# Altium schematic sheet Ponte_H.SchDoc
size A4
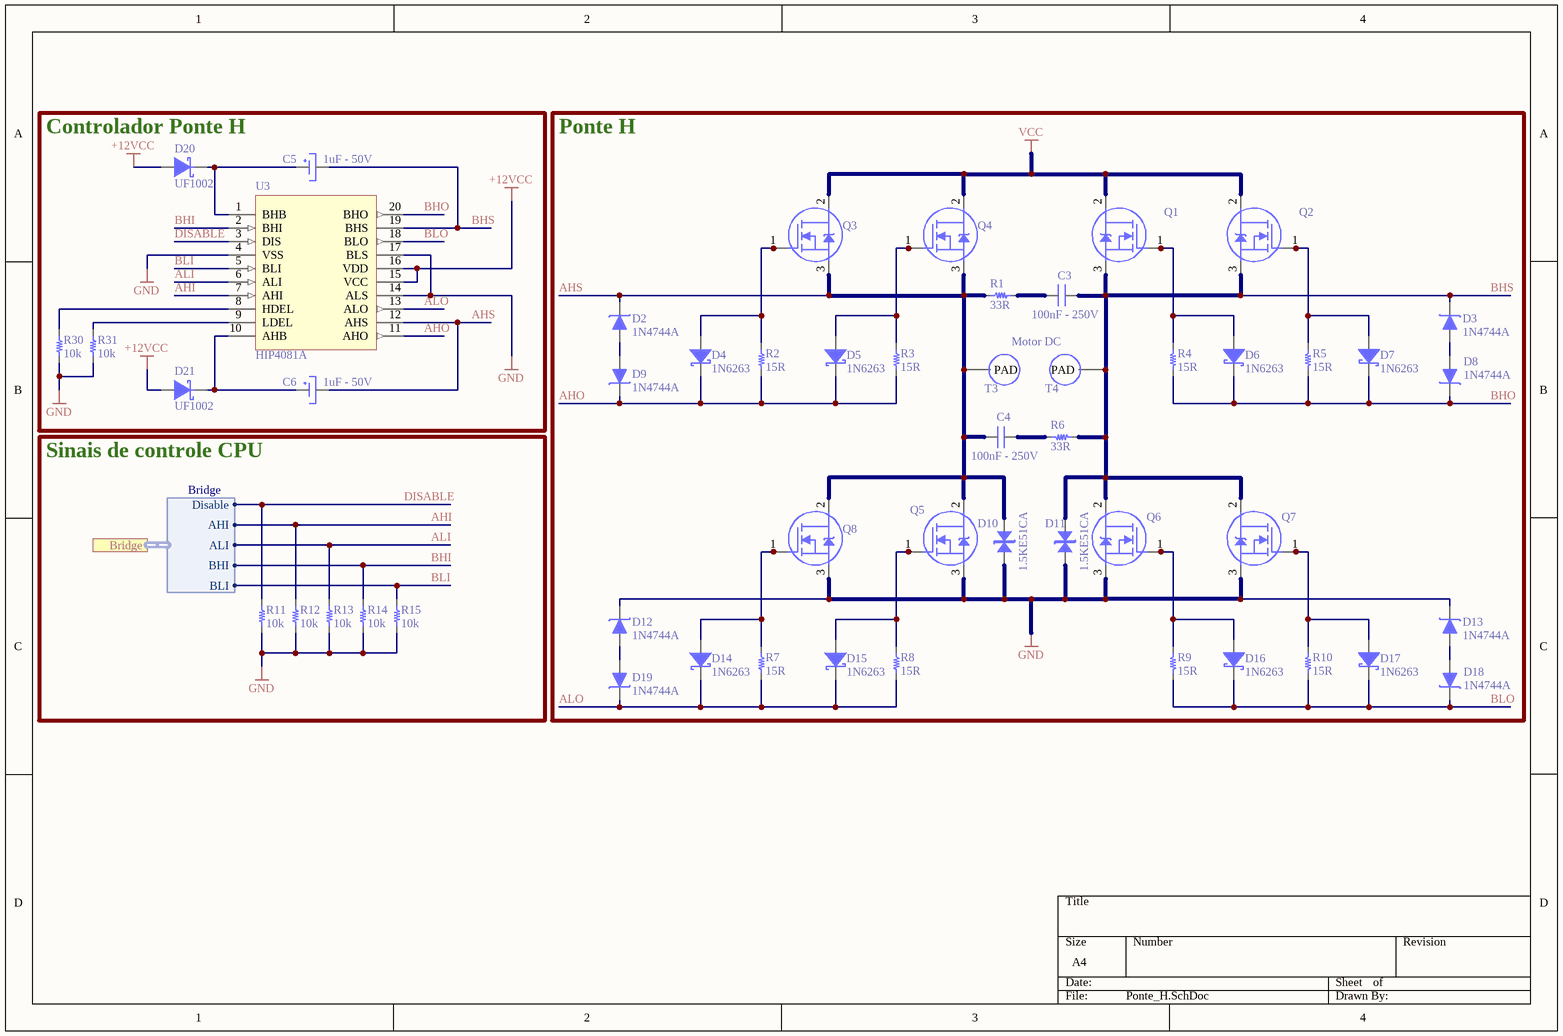
[diagram p0: Ponte_H.SchDoc]

## Parts
C3  100nF - 250V  [Capacitor_PTH]
C4  100nF - 250V  [Capacitor_PTH]
C5  1uF - 50V  [CAPACITOR_SMD]
C6  1uF - 50V  [CAPACITOR_SMD]
D2  1N4744A  [Diode_PHT]
D3  1N4744A  [Diode_PHT]
D4  1N6263  [Diode_PHT]
D5  1N6263  [Diode_PHT]
D6  1N6263  [Diode_PHT]
D7  1N6263  [Diode_PHT]
D8  1N4744A  [Diode_PHT]
D9  1N4744A  [Diode_PHT]
D10  1.5KE51CA  [DO-201]
D11  1.5KE51CA  [DO-201]
D12  1N4744A  [Diode_PHT]
D13  1N4744A  [Diode_PHT]
D14  1N6263  [Diode_PHT]
D15  1N6263  [Diode_PHT]
D16  1N6263  [Diode_PHT]
D17  1N6263  [Diode_PHT]
D18  1N4744A  [Diode_PHT]
D19  1N4744A  [Diode_PHT]
D20  UF1002  [Diode_PHT]
D21  UF1002  [Diode_PHT]
Q1  IRF1405  [TO-220AB]  (value not drawn)
Q2  IRF1405  [TO-220AB]  (value not drawn)
Q3  IRF1405  [TO-220AB]  (value not drawn)
Q4  IRF1405  [TO-220AB]  (value not drawn)
Q5  IRF1405  [TO-220AB]  (value not drawn)
Q6  IRF1405  [TO-220AB]  (value not drawn)
Q7  IRF1405  [TO-220AB]  (value not drawn)
Q8  IRF1405  [TO-220AB]  (value not drawn)
R1  33R  [Resistor_PTH]
R2  15R  [R_0805]
R3  15R  [R_0805]
R4  15R  [R_0805]
R5  15R  [R_0805]
R6  33R  [Resistor_PTH]
R7  15R  [R_0805]
R8  15R  [R_0805]
R9  15R  [R_0805]
R10  15R  [R_0805]
R11  10k  [R_0805]
R12  10k  [R_0805]
R13  10k  [R_0805]
R14  10k  [R_0805]
R15  10k  [R_0805]
R30  10k  [R_0805]
R31  10k  [R_0805]
T3  Power_Pad  [Power_Pad]  (value not drawn)
T4  Power_Pad  [Power_Pad]  (value not drawn)
U3  HIP4081A  [PDIP20]

## Blocks framed on the sheet
Controlador Ponte H: C5 C6 D20 D21 R30 R31 U3
Ponte H: C3 C4 D2-D19 Q1-Q8 R1-R10 T3 T4
Sinais de controle CPU: R11-R15

## Ports
Bridge (harness Bridge)

## Harnesses
Bridge: Disable, AHI, ALI, BHI, BLI

## Nets
+12VCC: D20.A(Anodo) D21.A(Anodo) U3.15(VCC) U3.16(VDD)
GND: D10.A(Anodo) D11.A(Anodo) D12.K(Catodo) D13.K(Catodo) Q5.3(Source) Q6.3(Source) Q7.3(Source) Q8.3(Source) R11.1 R12.1 R13.1 R14.1 R15.1 R30.1 R31.1 U3.4(VSS) U3.14(ALS) U3.17(BLS)
VCC: Q1.2(Drain) Q2.2(Drain) Q3.2(Drain) Q4.2(Drain)
AHI: R12.2 U3.7(AHI) ; port Bridge.AHI
AHO: D4.K(Catodo) D5.K(Catodo) D9.K(Catodo) R2.1 R3.1 U3.11(AHO)
AHS: C4.1 C6.1 D2.K(Catodo) D10.K(Catodo) Q3.3(Source) Q4.3(Source) Q5.2(Drain) Q8.2(Drain) R1.1 T3.1(PAD) U3.12(AHS)
ALI: R13.2 U3.6(ALI) ; port Bridge.ALI
ALO: D14.K(Catodo) D15.K(Catodo) D19.K(Catodo) R7.1 R8.1 U3.13(ALO)
BHI: R14.2 U3.2(BHI) ; port Bridge.BHI
BHO: D6.K(Catodo) D7.K(Catodo) D8.K(Catodo) R4.1 R5.1 U3.20(BHO)
BHS: C3.1 C5.1 D3.K(Catodo) D11.K(Catodo) Q1.3(Source) Q2.3(Source) Q6.2(Drain) Q7.2(Drain) R6.1 T4.1(PAD) U3.19(BHS)
BLI: R15.2 U3.5(BLI) ; port Bridge.BLI
BLO: D16.K(Catodo) D17.K(Catodo) D18.K(Catodo) R9.1 R10.1 U3.18(BLO)
DISABLE: R11.2 U3.3(DIS) ; port Bridge.Disable
NetC3_2: C3.2 R1.2
NetC4_2: C4.2 R6.2
NetC5_2: C5.2 D20.K(Catodo) U3.1(BHB)
NetC6_2: C6.2 D21.K(Catodo) U3.10(AHB)
NetD2_A: D2.A(Anodo) D9.A(Anodo)
NetD3_A: D3.A(Anodo) D8.A(Anodo)
NetD4_A: D4.A(Anodo) Q3.1(Gate) R2.2
NetD5_A: D5.A(Anodo) Q4.1(Gate) R3.2
NetD6_A: D6.A(Anodo) Q1.1(Gate) R4.2
NetD7_A: D7.A(Anodo) Q2.1(Gate) R5.2
NetD12_A: D12.A(Anodo) D19.A(Anodo)
NetD13_A: D13.A(Anodo) D18.A(Anodo)
NetD14_A: D14.A(Anodo) Q8.1(Gate) R7.2
NetD15_A: D15.A(Anodo) Q5.1(Gate) R8.2
NetD16_A: D16.A(Anodo) Q6.1(Gate) R9.2
NetD17_A: D17.A(Anodo) Q7.1(Gate) R10.2
NetR30_2: R30.2 U3.8(HDEL)
NetR31_2: R31.2 U3.9(LDEL)

## Notes on the sheet
- Motor DC

## Library data of the parts
C3 C4 = 100nF - 250V: Capacitor_100nF Poliester; Supplier Part Number 1: 495-2426-ND; Supplier 1: Digi-Key
C5 C6 = 1uF - 50V: Capacitor_1uF_50V; ComponentLink1Description: Datasheet; ComponentLink1URL: https://industrial.panasonic.com/cdbs/www-data/pdf/RDF0000/ABA0000C1209.pdf; Supplier 2: Mouser; Supplier Part Number 1: P11276-ND; Supplier Part Number 2: 667-EEU-FC1J681S; Supplier 1: Digi-Key
D2 D3 D8 D9 D12 D13 D18 D19 = 1N4744A: Diodo Zener 15V 200mA; ComponentLink1Description: Datasheet; ComponentLink1URL: https://www.diodes.com/assets/Datasheets/ds25002.pdf; Supplier 1: Mouser; Supplier Part Number 1: 821-1N4744A
D4-D7 D14-D17 = 1N6263: Diodo Schottky 60V - 15mA; Supplier 1: Digi-Key; Supplier Part Number 1: 497-2508-1-ND
D10 D11 = 1.5KE51CA: Transzorb; Supplier Part Number 1: 576-1.5KE51CA; Supplier 1: Mouser
D20 D21 = UF1002: UltraFast Diode 1.0A; Supplier Part Number 1: 621-UF1002-T; ComponentLink1Description: Datasheet; ComponentLink1URL: https://www.diodes.com/assets/Datasheets/ds25002.pdf; Supplier 1: Mouser
Q1-Q8 = IRF1405: MOSFET transistor; Supplier 1: Digi-Key; Supplier 2: Mouser; Supplier Part Number 1: IRF1405PBF-ND; Supplier Part Number 2: 942-IRF1405PBF; ComponentLink1Description: Datasheet; ComponentLink1URL: https://www.infineon.com/dgdl/irf1405pbf.pdf?fileId=5546d462533600a4015355db084a18bb
R1 R6 = Resistor_33R: Resistor PHT; Supplier 1: Newark; Supplier Part Number 1: 78R4744
R2-R5 R7-R10 = Resistor_15R: Resistor padrão 0805; Supplier 1: Arrow; Supplier 2: Digi-Key; Supplier 3: Arrow; Supplier Part Number 1: CRCW080515R0FKEA**MULT1; Supplier Part Number 2: 541-15.0CDKR-ND; Supplier Part Number 3: CRCW080515R0FKEA
R11-R15 R30 R31 = Resistor_10K: Resistor padrão 0805; Supplier 1: Mouser; Supplier 2: Digi-Key; Supplier Part Number 1: 603-RC0805FR-0710KL; Supplier Part Number 2: 311-10.0KCRCT-ND
T3 T4 = Power_Pad: Terminal de alta potência para soldar os cabos de potência
U3 = HIP4081A: High Frequency Full Bridge FET Driver; Supplier 1: Mouser; Supplier 2: Digi-Key; Supplier Part Number 1: 968-HIP4081AIPZ; Supplier Part Number 2: HIP4081AIPZ-ND; ComponentLink1Description: Datasheet; ComponentLink1URL: https://www.intersil.com/content/dam/Intersil/documents/hip4/hip4081a.pdf